# EAGLE design Temperature Sensor Rev.1 (EAGLE 7.6.0)
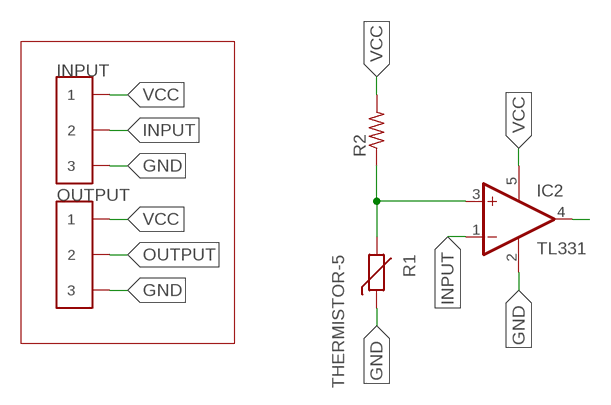
[diagram p0: schematic, sheet 1]

## Parts
IC2  TL331  [DBV-R-PDSO-G5]
INPUT  CONN_3  [CONNECTOR_3]
OUTPUT  CONN_3  [CONNECTOR_3]
R1  THERMISTOR-5  [R-5]
R2  R-US_R0805  [R0805]

## Nets
GND: IC2.2(GND) INPUT.5 INPUT.6 OUTPUT.5 OUTPUT.6 R1.1
INPUT: IC2.1(-IN) INPUT.3 INPUT.4
N$1: IC2.3(+IN) R1.2 R2.1
OUTPUT: IC2.4(OUT) OUTPUT.3 OUTPUT.4
VCC: IC2.5(V+) INPUT.1 INPUT.2 OUTPUT.1 OUTPUT.2 R2.2

## Library data of the parts
IC2 = linear:TL331: SINGLE DIFFERENTIAL COMPARATOR Source: Data sheet <http://www.ti.com/lit/ds/symlink/tl331-q1.pdf>
INPUT OUTPUT = formula electric:CONN_3
R1 = varistor:THERMISTOR: THERMISTOR
R2 = resistor:R-US_: RESISTOR, American symbol

## Board
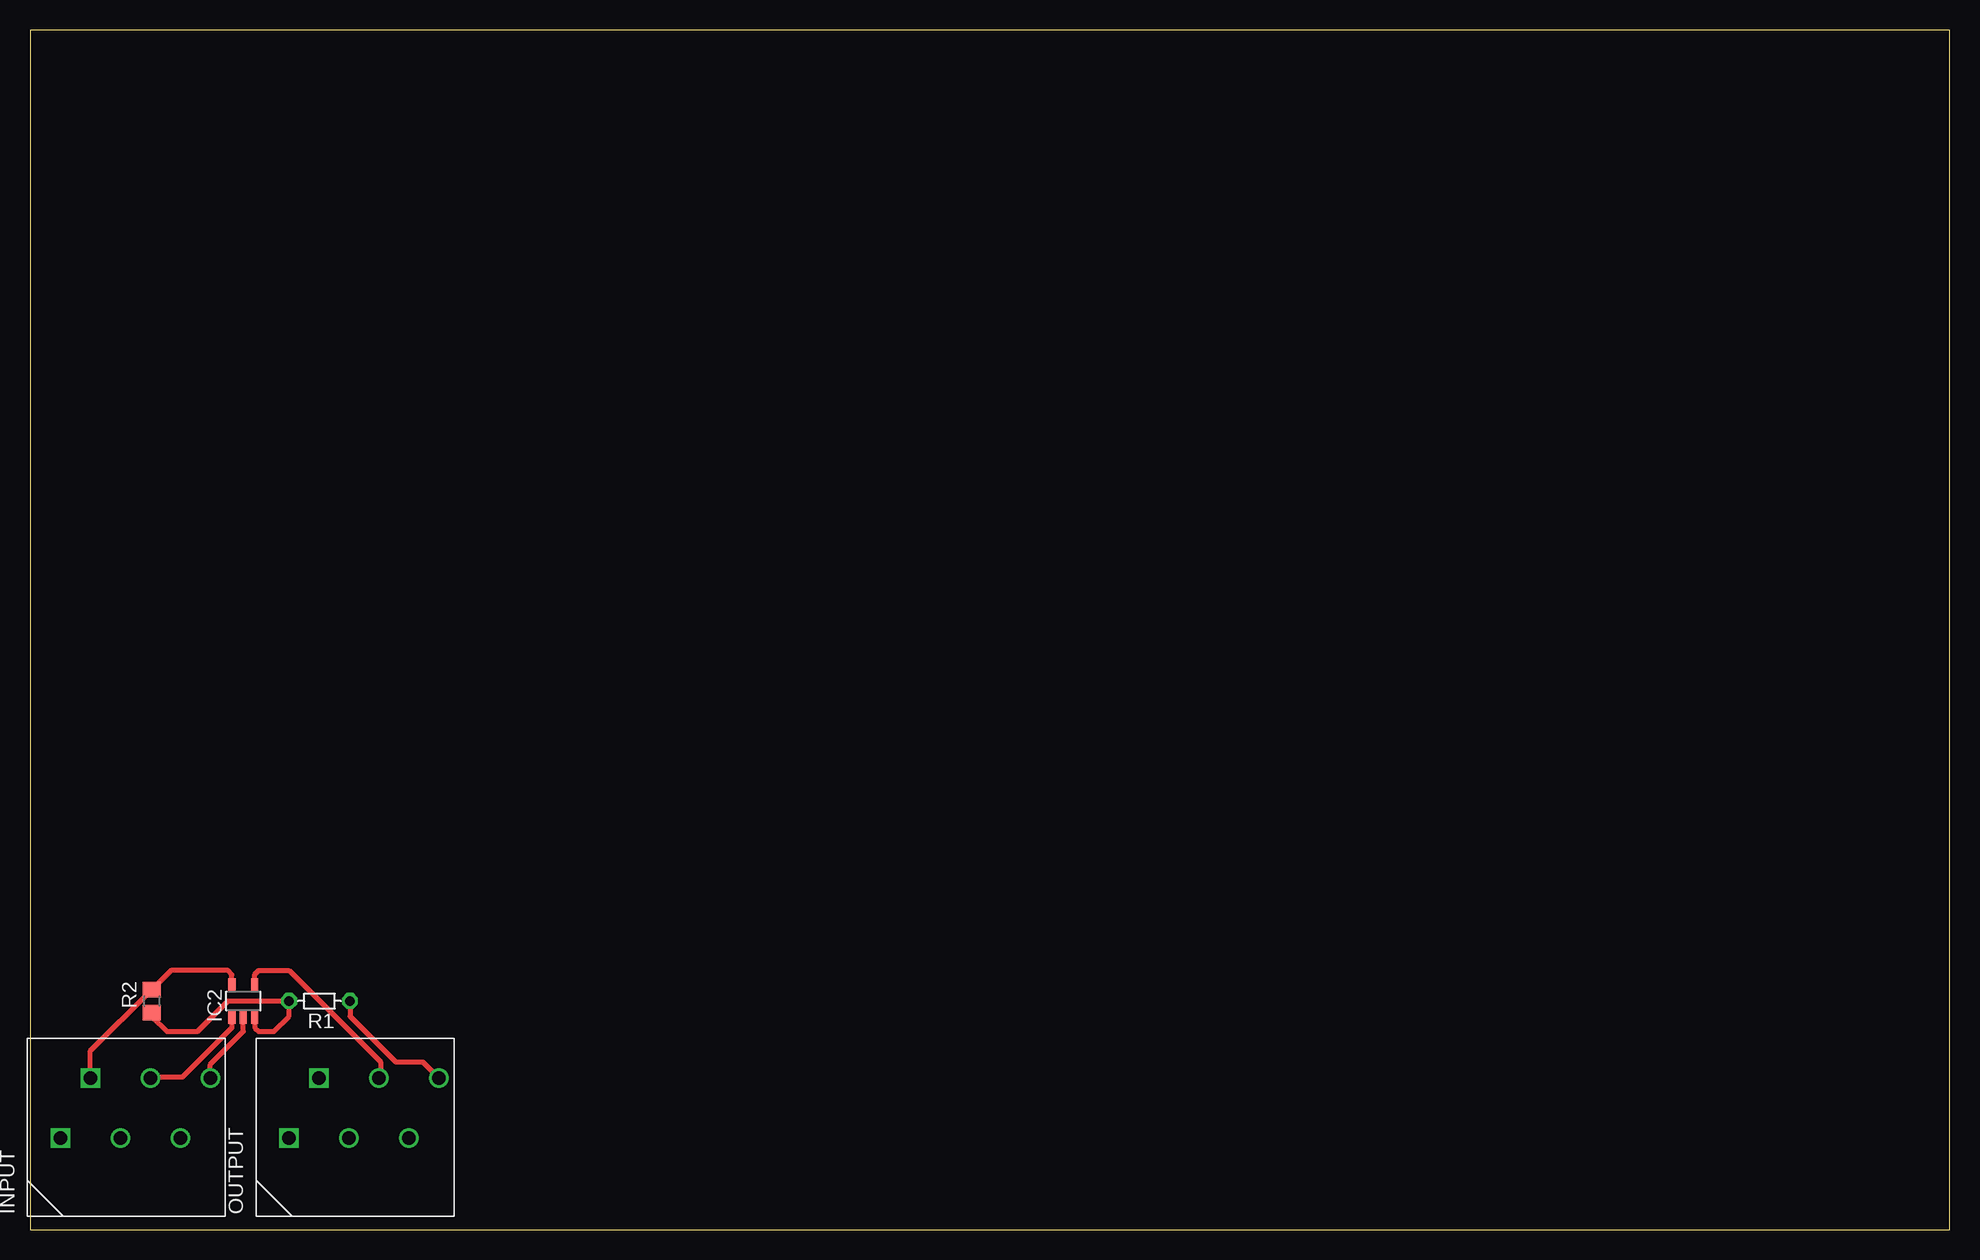
[diagram p1: board, top side]
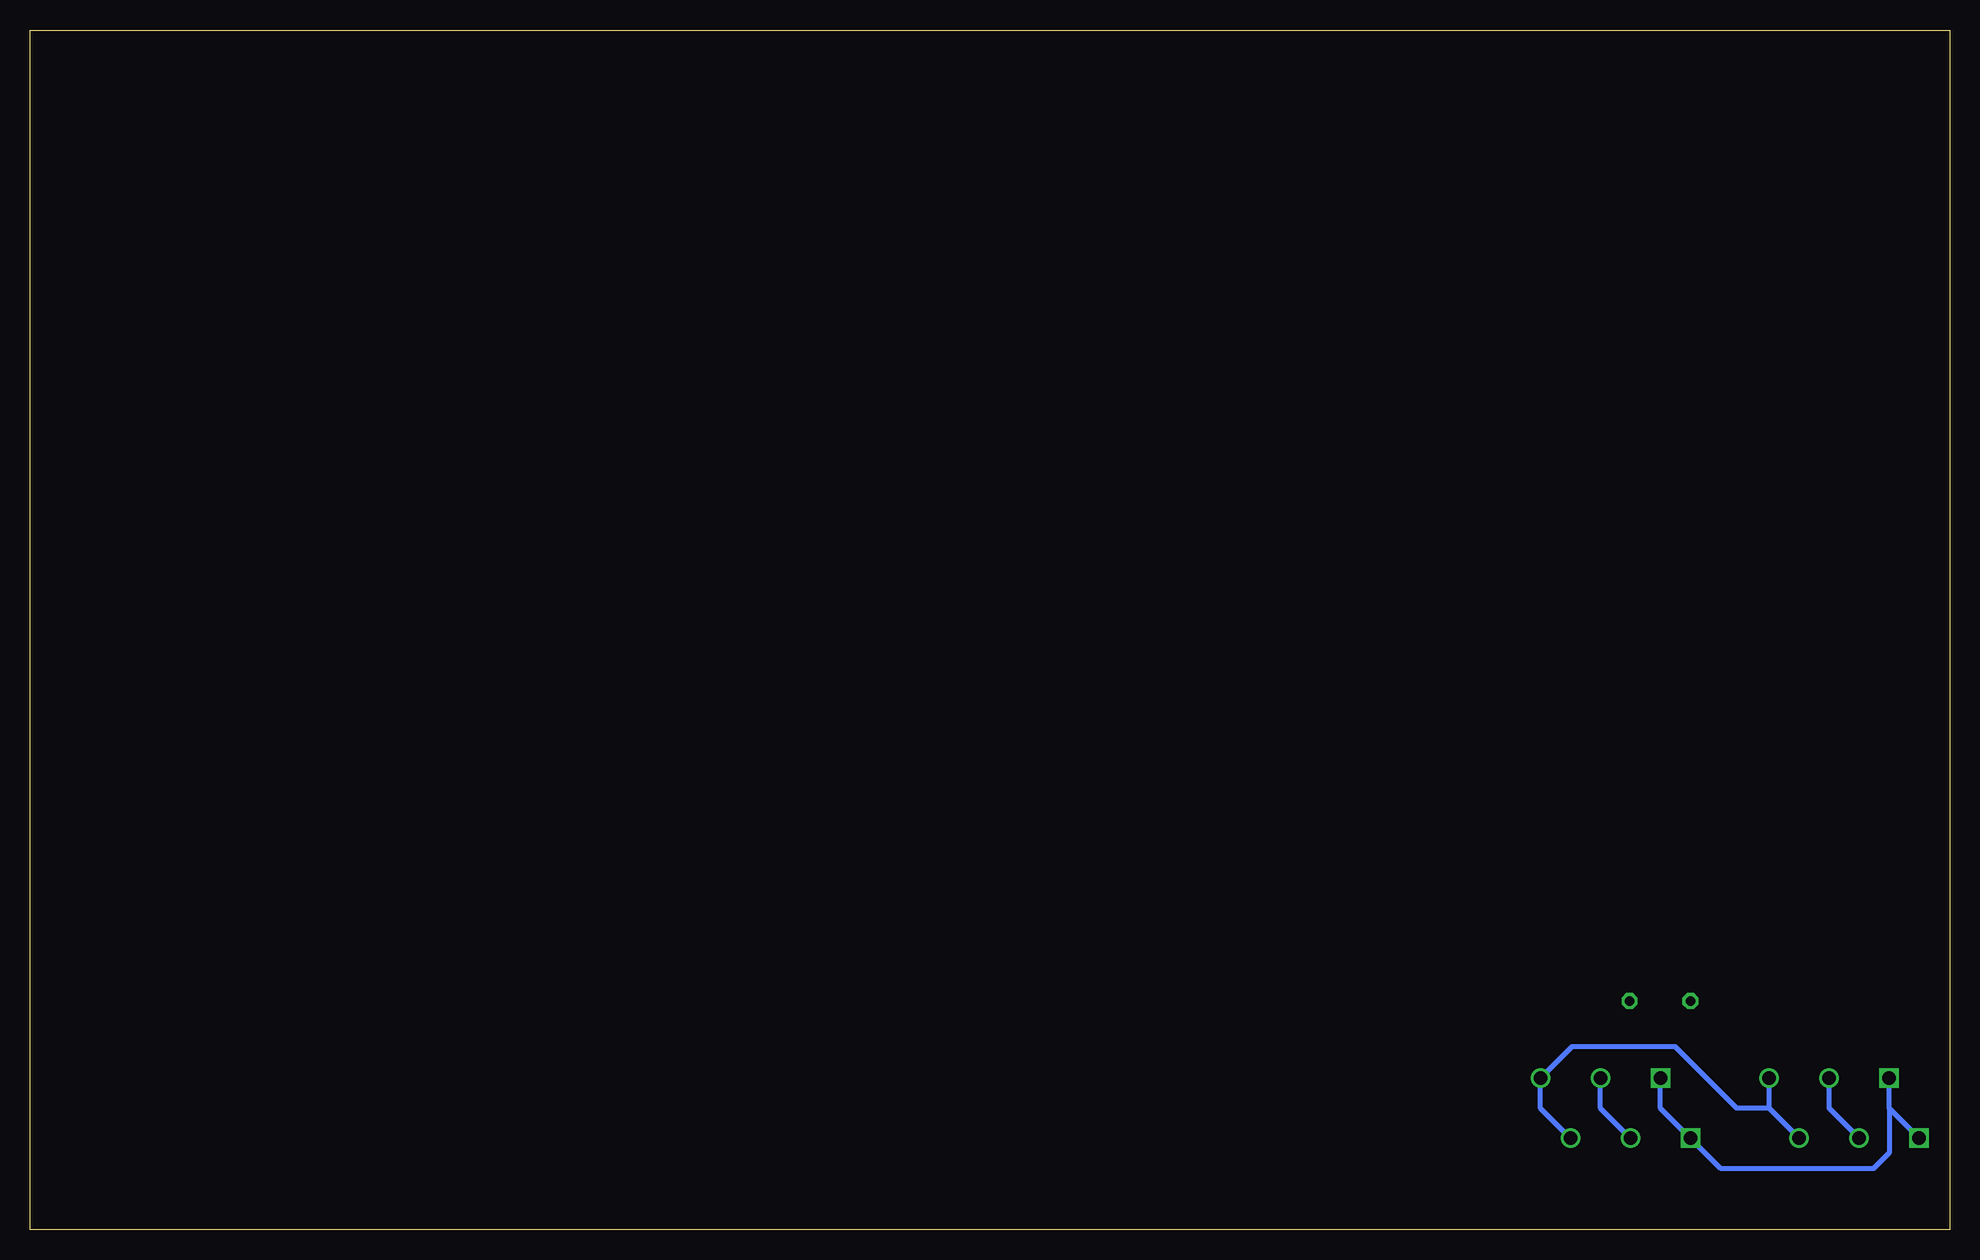
[diagram p2: board, bottom side, seen from below]

Size 160 x 100 mm. Coordinates in mm from the lower left corner, seen from the top.
Outline: 0,0 160,0 160,100 0,100 0,0
Copper layers (1*16): Top 0.035mm / dielectric 1.5mm / Bottom 0.035mm
Design rules "default": minimum track width 10mil, minimum drill 24mil, track to track 8mil, track to pad 8mil, pad to pad 8mil, via to via 8mil, smd to smd 8mil, copper to edge 40mil, drill to drill 8mil, minimum pad ring 10mil, minimum via ring 8mil, stop-mask expansion 4mil, vias tented up to drill 0mil, thermal gap 10mil

### Footprints (pad centres in the part's own frame; a part is rotated, then mirrored left to right if it is on the bottom)
DBV-R-PDSO-G5 = smd 0.6 x 1.2: 1 -0.95,-1.306; 2 0,-1.306; 3 0.95,-1.306; 4 0.95,1.306; 5 -0.95,1.306
CONNECTOR_3 = drill 1.1 square: 1 0,0; 2 2.5,5 | drill 1.1: 3 5,0; 4 7.5,5; 5 10,0; 6 12.5,5
R-5 = drill 0.813 octagon: 1 -2.54,0; 2 2.54,0
R0805 = smd 1.3 x 1.5: 1 -0.95,0; 2 0.95,0

### Placement (x,y rotation side)
IC2  17.78,19.05 0 top
INPUT  2.54,7.62 0 top
OUTPUT  21.59,7.62 0 top
R1  24.13,19.05 180 top
R2  10.16,19.05 90 top

### Tracks (layer width: path | path; a pad name or v marks a point on that pad's centre or on a via)
GND
  Top 0.406: INPUT.6 15.04,13.77 17.78,16.51 IC2.2 | R1.1 26.67,17.78 30.48,13.97 32.74,13.97 OUTPUT.6
  Bottom 0.406: INPUT.5 15.04,10.12 | 15.04,10.12 INPUT.6 | OUTPUT.5 34.09,10.12 OUTPUT.6 31.47,15.24 22.86,15.24 17.74,10.12 15.04,10.12
INPUT
  Top 0.406: IC2.1 16.83,16.83 12.7,12.7 10.12,12.7 INPUT.4
  Bottom 0.406: INPUT.3 10.04,10.12 INPUT.4
N$1
  Top 0.406: IC2.3 18.73,16.83 19.05,16.51 20.32,16.51 21.59,17.78 R1.2 16.51,19.05 13.97,16.51 11.43,16.51 10.16,17.78 R2.1
OUTPUT
  Top 0.406: IC2.4 18.73,21.27 19.05,21.59 21.59,21.59 29.21,13.97 29.21,12.74 OUTPUT.4
  Bottom 0.406: OUTPUT.3 29.09,10.12 OUTPUT.4
VCC
  Top 0.406: INPUT.2 5.04,14.88 R2.2 11.75,21.59 16.51,21.59 16.83,21.27 IC2.5
  Bottom 0.406: INPUT.1 5.04,10.12 | 5.04,10.12 INPUT.2 | OUTPUT.2 24.09,10.12 OUTPUT.1 19.05,5.08 6.35,5.08 5.04,6.39 5.04,10.12